# EAGLE schematic led copy (EAGLE 9.6.2)
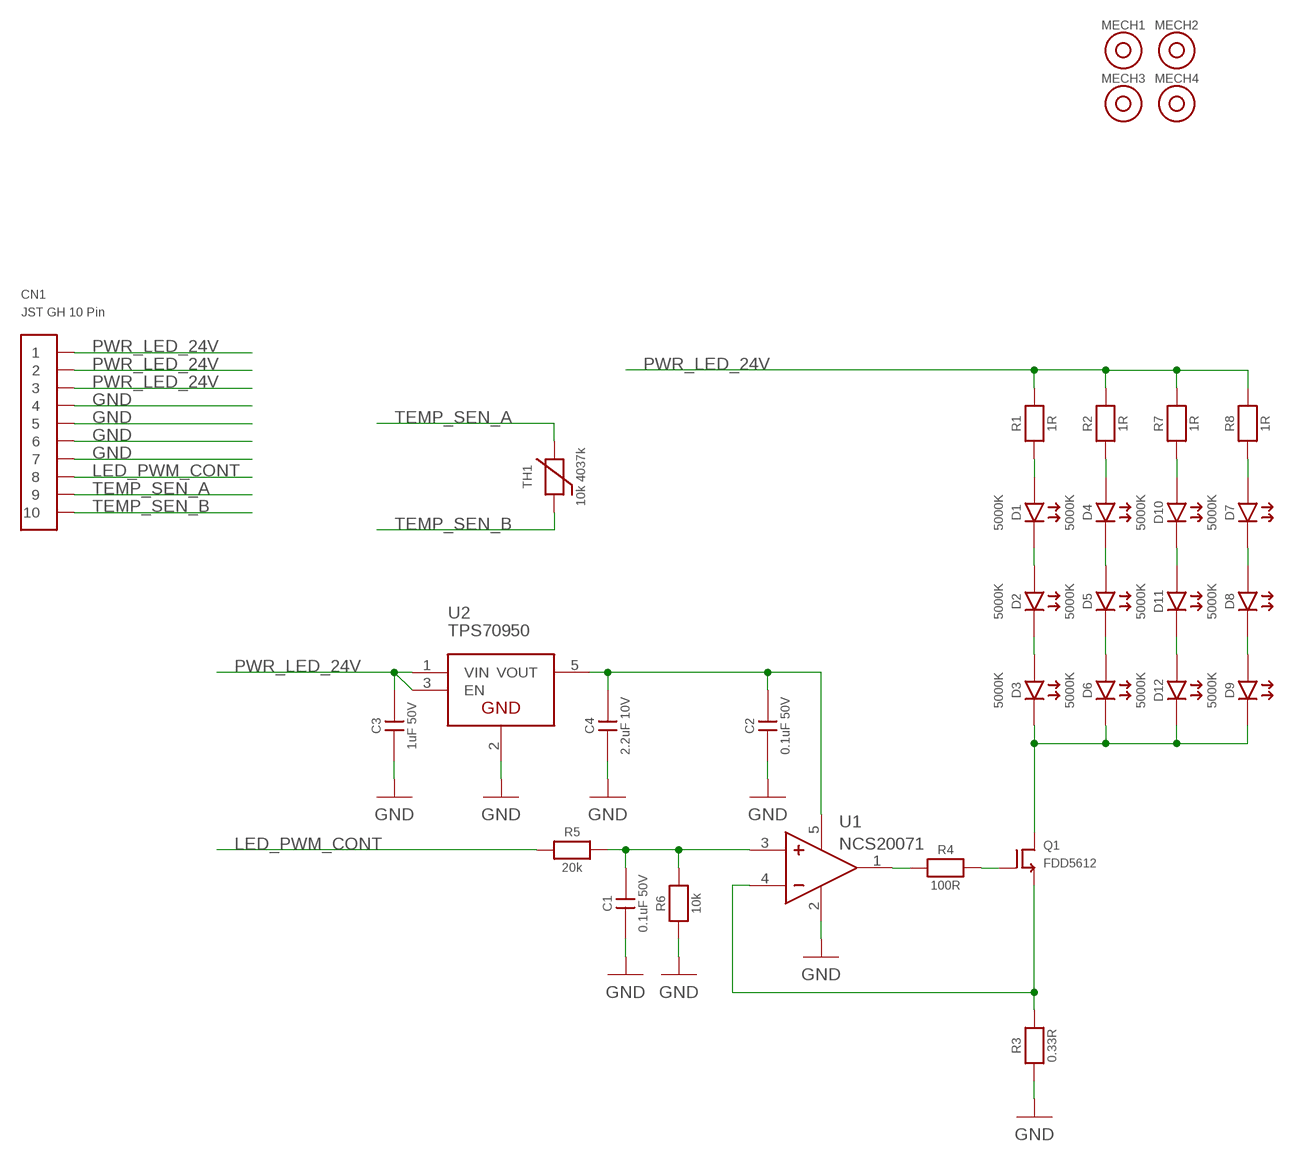
[diagram p0: schematic, sheet 1]

## Parts
C1  0.1uF 50V  C0603C104K5RAC7081  [0603]
C2  0.1uF 50V  C0603C104K5RAC7081  [0603]
C3  1uF 50V  C1206C105K5RACAUTO  [1206]
C4  2.2uF 10V  CL10B225KP8NFNC  [0603]
CN1  JST GH 10 Pin  1.25-10PWT  [1.25-10PWT]
D1  5000K  SPHWH1L5N605YER3A4  [LH502C]
D2  5000K  SPHWH1L5N605YER3A4  [LH502C]
D3  5000K  SPHWH1L5N605YER3A4  [LH502C]
D4  5000K  SPHWH1L5N605YER3A4  [LH502C]
D5  5000K  SPHWH1L5N605YER3A4  [LH502C]
D6  5000K  SPHWH1L5N605YER3A4  [LH502C]
D7  5000K  SPHWH1L5N605YER3A4  [LH502C]
D8  5000K  SPHWH1L5N605YER3A4  [LH502C]
D9  5000K  SPHWH1L5N605YER3A4  [LH502C]
D10  5000K  SPHWH1L5N605YER3A4  [LH502C]
D11  5000K  SPHWH1L5N605YER3A4  [LH502C]
D12  5000K  SPHWH1L5N605YER3A4  [LH502C]
MECH1  6mm x 3mm  MOUNTHOLE  [MOUNTHOLE_6X3]
MECH2  6mm x 3mm  MOUNTHOLE  [MOUNTHOLE_6X3]
MECH3  6mm x 3mm  MOUNTHOLE  [MOUNTHOLE_6X3]
MECH4  6mm x 3mm  MOUNTHOLE  [MOUNTHOLE_6X3]
Q1  FDD5612  [TO252]
R1  1R  CRCW12061R00FKEA  [1206]
R2  1R  CRCW12061R00FKEA  [1206]
R3  0.33R  CRL0603-FW-R330ELF  [0603]
R4  100R  CRCW0603100RFKEC  [0603]
R5  20k  CRCW060320K0FKEA  [0603]
R6  10k  CRCW060310K0FKTA  [0603]
R7  1R  CRCW12061R00FKEA  [1206]
R8  1R  CRCW12061R00FKEA  [1206]
TH1  10k 4037k  NTCG164BF103HT1  [0603]
U1  NCS20071  NCS20071SN2T1G  [SOT23-5]
U2  TPS70950  TPS70950DBVT  [SOT23-5]

## Nets
GND: C1.1 C2.1 C3.1 C4.1 CN1.4 CN1.5 CN1.6 CN1.7 R3.1 R6.1 U1.2(V-) U2.2(GND)
LED_PWM_CONT: CN1.8 R5.1
N$1: D1.K D2.A
N$2: D2.K D3.A
N$3: D7.K D8.A
N$4: D4.K D5.A
N$5: D5.K D6.A
N$6: D4.A R2.1
N$7: D8.K D9.A
N$8: D10.A R7.1
N$9: D7.A R8.1
N$10: D11.K D12.A
N$11: D10.K D11.A
N$13: D1.A R1.1
N$16: D3.K D6.K D9.K D12.K Q1.2(D)
N$17: C1.2 R5.2 R6.2 U1.3(+)
N$18: Q1.1(G) R4.2
N$19: R4.1 U1.1(OUT)
N$20: Q1.3(S) R3.2 U1.4(-)
N$22: C2.2 C4.2 U1.5(V+) U2.5(VOUT)
PWR_LED_24V: C3.2 CN1.1 CN1.2 CN1.3 R1.2 R2.2 R7.2 R8.2 U2.1(VIN) U2.3(EN)
TEMP_SEN_A: CN1.9 TH1.2
TEMP_SEN_B: CN1.10 TH1.1

## Library data of the parts
C1 C2 = c_0603:C0603C104K5RAC7081: 100000 50V 0.1µF ±10% X7R 0603; DIGIKEY: 399-C0603C104K5RAC7081CT-ND; HEIGHT: -; MANUFACTURER: KEMET; PRICE_PER: 0.09000; STOCK: 513; TEMP_CO: X7R; TOLERANCE: ±10%; VOLTAGE: 50V
C3 = c_1206:C1206C105K5RACAUTO: 1000000 50V 1µF ±10% X7R 1206; DIGIKEY: 399-7011-1-ND; HEIGHT: -; MANUFACTURER: KEMET; PRICE_PER: 0.24000; STOCK: 420766; TEMP_CO: X7R; TOLERANCE: ±10%; VOLTAGE: 50V
C4 = c_0603:CL10B225KP8NFNC: 2200000 10V 2.2µF ±10% X7R 0603; DIGIKEY: 1276-2016-1-ND; HEIGHT: -; MANUFACTURER: Samsung Electro-Mechanics; PRICE_PER: 0.09000; STOCK: 44920; TEMP_CO: X7R; TOLERANCE: ±10%; VOLTAGE: 10V
CN1 = CONNECTORs:1.25-10PWT: 1x10P GH 10P 1 1.25mm 10 -25℃~+85℃ 1A Surface Mount，Right Angle SMD,P=1.25mm,Surface Mount，Right Angle Wire To Board / Wire To Wire Connector ROHS; HEIGHT: 3.6; LCSC: C5340797; PRICE_PER: 0.035
D1-D12 = OPTO:SPHWH1L5N605YER3A4: LED Lighting LH502C White, Cool 5000K 3-Step MacAdam Ellipse 6.1V 640mA 120° 2020 (5050 Metric); DIGIKEY: 1510-SPHWH1L5N605YER3A4CT-ND; HEIGHT: 1; PRICE_PER: 0.59
MECH1-MECH4 = MISC:MOUNTHOLE: Mechanical mounting hole.
Q1 = TRANSISTORs:FDD5612: MOSFET Transistor, N Channel, 18 A, 60 V, 0.036 ohm, 10 V, 2.4 V; FARNELL: 1653649; PRICE_PER: 0.259
R1 R2 R7 R8 = RESISTORS:CRCW12061R00FKEA: 1 1R0 1206 0.25W 1% thick film resistor.; DIGIKEY: 541-1.00FFCT-ND; HEIGHT: 0.65; PRICE_PER: 0.08
R3 = RESISTORS:CRL0603-FW-R330ELF: 0.33 0.33R 0603 0.1W 1% thick film resistor.; FARNELL: 2328096; HEIGHT: 0.5; PRICE_PER: 0.141
R4 = r_0603:CRCW0603100RFKEC: 100 ±1% 100 Ohms Thick Film 0.1W, 1/10W 0603; DIGIKEY: 541-2975-1-ND; HEIGHT: 1; MANUFACTURER: Vishay Dale; POWER: 0.1W, 1/10W; PRICE_PER: 0.07000; STOCK: 44; TOLERANCE: ±1%
R5 = r_0603:CRCW060320K0FKEA: 20000 ±1% 20k Thick Film 0.1W, 1/10W 0603; DIGIKEY: 541-20.0KHCT-ND; HEIGHT: 1; MANUFACTURER: Vishay Dale; POWER: 0.1W, 1/10W; PRICE_PER: 0.07000; STOCK: 25018; TOLERANCE: ±1%
R6 = r_0603:CRCW060310K0FKTA: 10000 ±1% 10k Thick Film 0.1W, 1/10W 0603; DIGIKEY: 541-2980-1-ND; HEIGHT: 1; MANUFACTURER: Vishay Dale; POWER: 0.1W, 1/10W; PRICE_PER: 0.12000; STOCK: 50797; TOLERANCE: ±1%
TH1 = RESISTORS:NTCG164BF103HT1: THERMISTOR NTC 10KOHM 4037K 0603; DIGIKEY: 445-180080-1-ND; HEIGHT: 1; PRICE_PER: 0.23
U1 = ICs:NCS20071SN2T1G: Operational Amplifier, Railto-Rail Output, 3 MHz BW; DIGIKEY: NCS20071SN2T1GOSCT-ND; HEIGHT: 1.5; PRICE_PER: 0.45
U2 = ICs:TPS70950DBVT: LDO Voltage Regulator, Fixed, 2.7V to 30V input, 690 mV drop., 5 V/150 mA out, SOT-23-5; DIGIKEY: 296-37567-1-ND; HEIGHT: 2; PRICE_PER: 1.21

## Net classes
1 USB: width 0.25 mm, drill 0.25 mm, clearance 1 mm